# Altium schematic sheet Equivalent Resistance RFBT 5V.SchDoc
size A; SheetNumber: 5; SheetTotal: 6
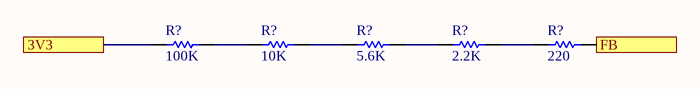
[diagram p0: Equivalent Resistance RFBT 5V.SchDoc]

## Parts
(Parts that share a designator on the sheet are numbered #1, #2 ... from top to bottom, then left to right.)
R?#1  value 100K  (hidden comment: Resistor)
R?#2  value 10K  (hidden comment: Resistor)
R?#3  value 5.6K  (hidden comment: Resistor)
R?#4  value 2.2K  (hidden comment: Resistor)
R?#5  value 220  (hidden comment: Resistor)

## Ports
3V3 (see Equivalent Inductance 3V3[3B], Equivalent Resistance RFBT 3V3[2B]), FB (see Equivalent Resistance RFBT 3V3[3B])

## Nets
3V3: R?#1.1 ; port 3V3
FB: R?#5.2 ; port FB
NetR?#1_2: R?#1.2 R?#2.1
NetR?#2_2: R?#2.2 R?#3.1
NetR?#3_2: R?#3.2 R?#4.1
NetR?#4_2: R?#4.2 R?#5.1

## Library data of the parts
R?#1-R?#5 = Resistor: TC1: 0; SimulationGenericComponent: True; TC2: 0